# Altium schematic sheet Buck-regulator.SchDoc
size A4
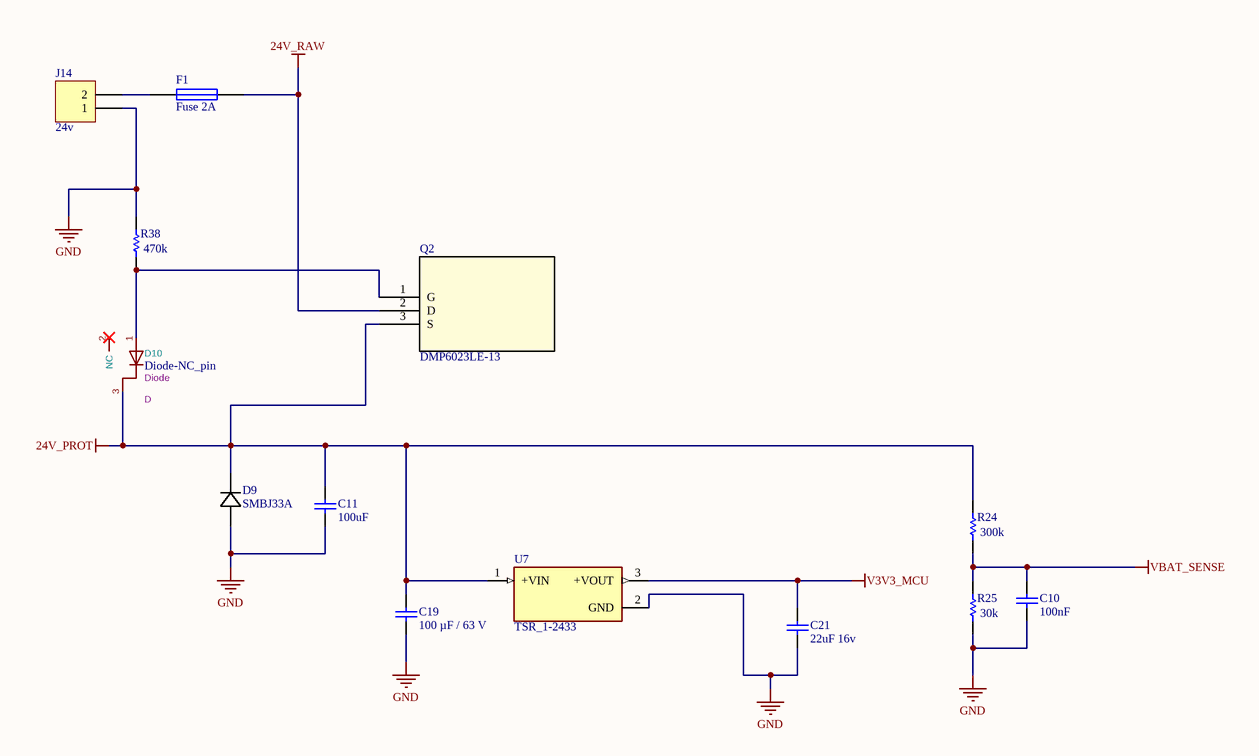
[diagram p0: Buck-regulator.SchDoc]

## Parts
C10  value 100nF  [CHIP0805-M]
C11  value 100uF  [RADIAL-D8-P35]  (hidden comment: 100 µF ≥63 V)
C19  100 µF / 63 V  [RADIAL-D8-P35]
C21  value 22uF 16v  [CHIP0805-M]  (hidden comment: 22 µF / 16 V)
D9  SMBJ33A  [SMB-DO214AA-M]
D10  Diode-NC_pin  value Diode  Reference: D  [SOT23-3-M]
F1  Fuse 2A  [FUSEHOLDER-5X20-P226]
J14  24v  [PHX-MC15-2-G-35]
Q2  DMP6023LE-13  [DMP6023LE-13_DIO-M]
R24  value 300k  [CHIP0805-M]  (hidden comment: pullup)
R25  value 30k  [CHIP0805-M]  (hidden comment: pullup)
R38  value 470k  [CHIP0805-M]  (hidden comment: pullup)
U7  TSR_1-2433  [CONV_TSR_1-2433]

## Nets
24V_PROT: C11.1 C19.1 D9.1 D10.3(K) Q2.3(S) R24.2 U7.1(+VIN)
24V_RAW: F1.2 Q2.2(D)
GND: C10.1 C11.2 C19.2 C21.1 D9.2 J14.1 R25.1 R38.2 U7.2(GND)
V3V3_MCU: C21.2 U7.3(+VOUT)
VBAT_SENSE: C10.2 R24.1 R25.2
NetD10_1: D10.1(A) Q2.1(G) R38.1
NetF1_1: F1.1 J14.2

Not connected (* = marked no-connect by the designer): D10 2(NC)*

## Library data of the parts
C10 C11 C19 C21 = Cap: Capacitor; Published: 8-Jun-2000; LatestRevisionDate: 17-Jul-2002; LatestRevisionNote: Re-released for DXP Platform.; PackageReference: RAD-0.3; Publisher: Altium Limited; PackageDescription: Radial Cap, Thru-Hole; 2 Leads; 0.3 in Pin Spacing
  C19: Value: 100 µF / 63 V
D9 = SMBJ33A: Description; Manufacturer_Name: Bourns Electronics; Copyright: Copyright (C) 2026 Ultra Librarian. All rights reserved.; Manufacturer_Part_Number: SMBJ33A
D10 = Diode-NC_pin: ki_keywords: Doide NC pin; ki_description: Diode with NC pin; Datasheet: https://diotec.com/de/produktliste/D.html
F1 = Fuse 1: Fuse; Published: 8-Jun-2000; LatestRevisionDate: 17-Jul-2002; LatestRevisionNote: Re-released for DXP Platform.; PackageReference: PIN-W2/E2.8; Publisher: Altium Limited; PackageDescription: Thru-Hole; 2 Leads
J14 = Header 2: Header, 2-Pin; LatestRevisionDate: 17-Jul-2002; LatestRevisionNote: Re-released for DXP Platform.; Publisher: Altium Limited
Q2 = DMP6023LE-13: Description; Manufacturer_Name: Diodes Inc; Copyright: Copyright (C) 2026 Ultra Librarian. All rights reserved.; Manufacturer_Part_Number: DMP6023LE-13; RefDes: RefDes; Type: Type
R24 R25 R38 = Res1: Resistor; Published: 8-Jun-2000; LatestRevisionDate: 17-Jul-2002; LatestRevisionNote: Re-released for DXP Platform.; PackageReference: AXIAL-0.3; Publisher: Altium Limited; PackageDescription: Axial Device, Thru-Hole; 2 Leads; 0.3 in Pin Spacing
U7 = TSR_1-2433: 1 Amp POL switching regulator, 4.6 to -36 VDC input, pos.-pos. circuit, LM78 compatible, SIP-3; MP: TSR 1-2433; MF: Traco Power; Purchase-URL: https://pricing.snapeda.com/search/part/TSR 1-2433/?ref=eda; Package: SIP-3 Traco Power; Availability: In Stock; Value: *; Price: None; SnapEDA_Link: https://www.snapeda.com/parts/TSR%201-2433/Traco%20Power/view-part/6027450/?ref=snap; Check_prices: https://www.snapeda.com/parts/TSR%201-2433/Traco%20Power/view-part/6027450/?ref=eda